# EAGLE design tinyusbboard (EAGLE 7.1.0)
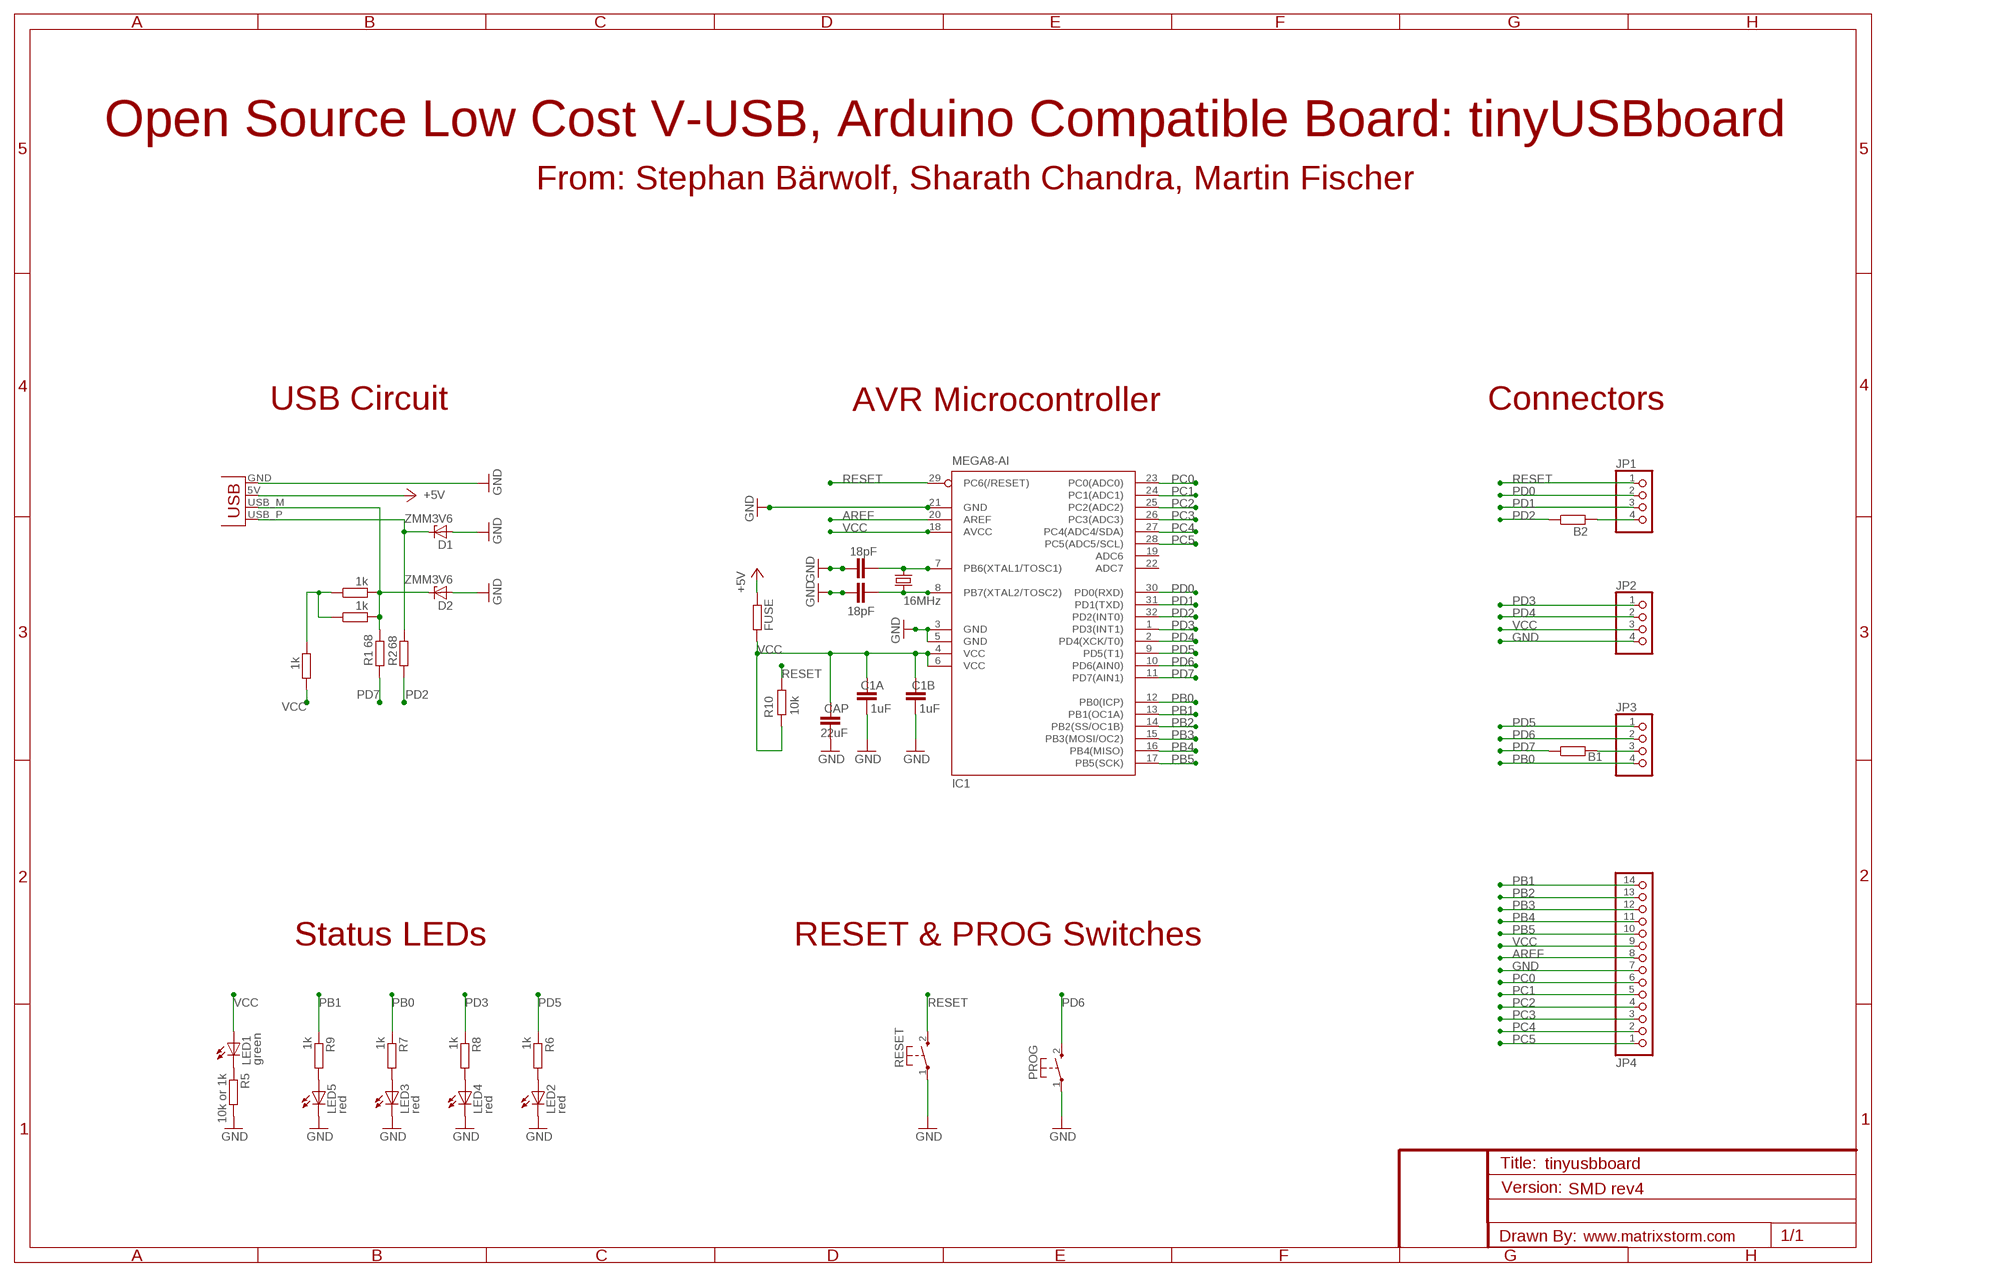
[diagram p0: schematic, sheet 1]

## Parts
AQ1  16MHz  CRYSTAL5X3  [CRYSTAL-SMD-5X3]
B1  0  R-EU_R0805W  [R0805W]
B2  0  R-EU_R0805W  [R0805W]
C1A  1uF  C-EUC0805K  [C0805K]
C1B  1uF  C-EUC0805K  [C0805K]
C2  18pF  C-EUC0805K  [C0805K]
C3  18pF  C-EUC0805K  [C0805K]
CAP  22uF  C-EUC1206K  [C1206K]
D1  ZMM3V6  ZD-SOD-80  [SOD80]
D2  ZMM3V6  ZD-SOD-80  [SOD80]
FUSE  0  R-EU_R1206W  [R1206W]
IC1  MEGA8-AI  [TQFP32-08]
JP1  PINHD-1X4  [1X04]
JP2  PINHD-1X4  [1X04]
JP3  PINHD-1X4  [1X04]
JP4  PINHD-1X14  [1X14]
LED1  green  LEDCHIPLED_0805  [CHIPLED_0805]
LED2  red  LEDCHIPLED_0805  [CHIPLED_0805]
LED3  red  LEDCHIPLED_0805  [CHIPLED_0805]
LED4  red  LEDCHIPLED_0805  [CHIPLED_0805]
LED5  red  LEDCHIPLED_0805  [CHIPLED_0805]
PROG  KSS-2EG4430  [KSS-2EG4430]
Q1  16MHz  CRYSTALHC49S  [HC49/S]
R1  68  R-EU_R0805W  [R0805W]
R2  68  R-EU_R0805W  [R0805W]
R3  1k  R-EU_R0805W  [R0805W]
R3A  1k  R-EU_R0805W  [R0805W]
R3B  1k  R-EU_R0805W  [R0805W]
R5  10k or 1k  R-EU_R0805W  [R0805W]
R6  1k  R-EU_R0805W  [R0805W]
R7  1k  R-EU_R0805W  [R0805W]
R8  1k  R-EU_R0805W  [R0805W]
R9  1k  R-EU_R0805W  [R0805W]
R10  10k  R-EU_R0805W  [R0805W]
RESET  KSS-2EG4430  [KSS-2EG4430]
USB  USBPCB  [USB-A-PCB]

## Nets
+5V: FUSE.1 USB.5V(VBUS)
AREF: IC1.20(AREF) JP4.8
GND: C1A.2 C1B.2 C2.2 C3.2 CAP.2 D1.A D2.A IC1.3(GND) IC1.5(GND) IC1.21(GND) JP2.4 JP4.7 LED2.C LED3.C LED4.C LED5.C PROG.1(P) R5.2 RESET.1(P) USB.GND
N$3: D1.C R2.2 USB.USB_P(D+)
N$5: AQ1.1 C3.1 IC1.7(PB6(XTAL1/TOSC1)) Q1.1
N$6: AQ1.3 C2.1 IC1.8(PB7(XTAL2/TOSC2)) Q1.2
N$13: B2.2 JP1.4
N$27: D2.C R1.2 R3A.2 R3B.2 USB.USB_M(D-)
N$34: B1.2 JP3.3
N$35: LED1.C R5.1
N$36: LED2.A R6.2
N$37: R3.1 R3A.1 R3B.1
N$38: LED3.A R7.2
N$39: LED4.A R8.2
N$40: LED5.A R9.2
PB0: IC1.12(PB0(ICP)) JP3.4 R7.1
PB1: IC1.13(PB1(OC1A)) JP4.14 R9.1
PB2: IC1.14(PB2(SS/OC1B)) JP4.13
PB3: IC1.15(PB3(MOSI/OC2)) JP4.12
PB4: IC1.16(PB4(MISO)) JP4.11
PB5: IC1.17(PB5(SCK)) JP4.10
PC0: IC1.23(PC0(ADC0)) JP4.6
PC1: IC1.24(PC1(ADC1)) JP4.5
PC2: IC1.25(PC2(ADC2)) JP4.4
PC3: IC1.26(PC3(ADC3)) JP4.3
PC4: IC1.27(PC4(ADC4/SDA)) JP4.2
PC5: IC1.28(PC5(ADC5/SCL)) JP4.1
PD0: IC1.30(PD0(RXD)) JP1.2
PD1: IC1.31(PD1(TXD)) JP1.3
PD2: B2.1 IC1.32(PD2(INT0)) R2.1
PD3: IC1.1(PD3(INT1)) JP2.1 R8.1
PD4: IC1.2(PD4(XCK/T0)) JP2.2
PD5: IC1.9(PD5(T1)) JP3.1 R6.1
PD6: IC1.10(PD6(AIN0)) JP3.2 PROG.2(S)
PD7: B1.1 IC1.11(PD7(AIN1)) R1.1
RESET: IC1.29(PC6(/RESET)) JP1.1 R10.1 RESET.2(S)
VCC: C1A.1 C1B.1 CAP.1 FUSE.2 IC1.4(VCC) IC1.6(VCC) IC1.18(AVCC) JP2.3 JP4.9 LED1.A R3.2 R10.2
Unconnected: IC1.19(ADC6) IC1.22(ADC7)

## Notes on the sheet
- Open Source Low Cost V-USB, Arduino Compatible Board: tinyUSBboard
- From: Stephan Bärwolf, Sharath Chandra, Martin Fischer
- USB Circuit | AVR Microcontroller | Connectors
- Status LEDs | RESET & PROG Switches
- SMD rev4
- www.matrixstorm.com

## Library data of the parts
AQ1 = SparkFun:CRYSTAL: Crystals Various standard crystals. Proven footprints. Spark Fun Electronics SKU : COM-00534
B1 B2 FUSE R1-R3 R3A R3B R5-R10 = resistor:R-EU_: RESISTOR, European symbol
C1A C1B C2 C3 CAP = resistor:C-EU: CAPACITOR, European symbol
D1 D2 = diodes:ZD-: Zener diode
IC1 = atmel:MEGA8: MICROCONTROLLER 8 Kbytes FLASH, 1 kbytes SRAM, 512 bytes EEPROM, USART, 6-channel 10 bit ADC, 2-channel 8 bit ADC Pin compatible with Atmega48, ATMega88, ATMega168 Source: avr.lbr; MPN: ATMEGA8-16AU; OC_FARNELL: 9171371; OC_NEWARK: 73M8863
JP1-JP3 = pinhead:PINHD-1X4: PIN HEADER
JP4 = pinhead:PINHD-1X14: PIN HEADER
LED1-LED5 = led:LED: LED OSRAM: - CHIPLED LG R971, LG N971, LY N971, LG Q971, LY Q971, LO R971, LY R971 LH N974, LH R974 LS Q976, LO Q976, LY Q976 LO Q996 - Hyper CHIPLED LW Q18S LB Q993, LB Q99A, LB R99A - SideLED LS A670, LO A670, LY A670, LG A670, LP A670 LB A673, LV A673, LT A673, LW A673 LH A674 LY A675 LS A676, LA A676, LO A676, LY A676, LW A676 LS A679, LY A679, LG A679 - Hyper Micro SIDELED® LS Y876, LA Y876, LO Y876, LY Y876 LT Y87S - SmartLED LW L88C, LW L88S LB L89C, LB L89S, LG L890 LS L89K, LO L89K, LY L89K LS L896, LA L896, LO L896, LY L896 - TOPLED LS T670, LO T670, LY T670, LG T670, LP T670 LSG T670, LSP T670, LSY T670, LOP T670, LYG T670 LG T671, LOG T671, LSG T671 LB T673, LV T673, LT T673, LW T673 LH T674 LS T676, LA T676, LO T676, LY T676, LB T676, LH T676, LSB T676, LW T676 LB T67C, LV T67C, LT T67C, LS T67K, LO T67K, LY T67K, LW E67C LS E67B, LA E67B, LO E67B, LY E67B, LB E67C, LV E67C, LT E67C LW T67C LS T679, LY T679, LG T679 LS T770, LO T770, LY T770, LG T770, LP T770 LB T773, LV T773, LT T773, LW T773 LH T774 LS E675, LA E675, LY E675, LS T675 LS T776, LA T776, LO T776, LY T776, LB T776 LHGB T686 LT T68C, LB T68C - Hyper Mini TOPLED® LB M676 - Mini TOPLED Santana® LG M470 LS M47K, LO M47K, LY M47K Source: http://www.osram.convergy.de LUXEON: - LUMILED® LXK2-PW12-R00, LXK2-PW12-S00, LXK2-PW14-U00, LXK2-PW14-V00 LXK2-PM12-R00, LXK2-PM12-S00, LXK2-PM14-U00 LXK2-PE12-Q00, LXK2-PE12-R00, LXK2-PE12-S00, LXK2-PE14-T00, LXK2-PE14-U00 LXK2-PB12-K00, LXK2-PB12-L00, LXK2-PB12-M00, LXK2-PB14-N00, LXK2-PB14-P00, LXK2-PB14-Q00 LXK2-PR12-L00, LXK2-PR12-M00, LXK2-PR14-Q00, LXK2-PR14-R00 LXK2-PD12-Q00, LXK2-PD12-R00, LXK2-PD12-S00 LXK2-PH12-R00, LXK2-PH12-S00 LXK2-PL12-P00, LXK2-PL12-Q00, LXK2-PL12-R00 Source: www.luxeon.com KINGBRIGHT: KA-3528ASYC Source: www.kingbright.com
PROG RESET = buttons:KSS-2EG4430: Size: 3x6mm Height: 5mm from PCB Rating: DC12v 50mA Travel: 0.25±0.10mm Operating Force: 180±50gf Return Force: 60gf min Contact resistance: 100m? max Insulation resistance: 100M? min Operating life?50,000 cycles
Q1 = crystal:CRYSTAL: CRYSTAL; OC_FARNELL: 1667008; OC_NEWARK: unknown
USB = SparkFun:USB: USB Connectors USB-B-PTH is fully proven SKU : PRT-00139 USB-miniB is fully proven SKU : PRT-00587 USB-A-PCB is untested. USB-A-H is throughly reviewed, but untested. Spark Fun Electronics SKU : PRT-00437 USB-B-SMT is throughly reviewed, but untested. Needs silkscreen touching up. USB-A-S has not been used/tested USB-MB-H has not been used/tested

## Board
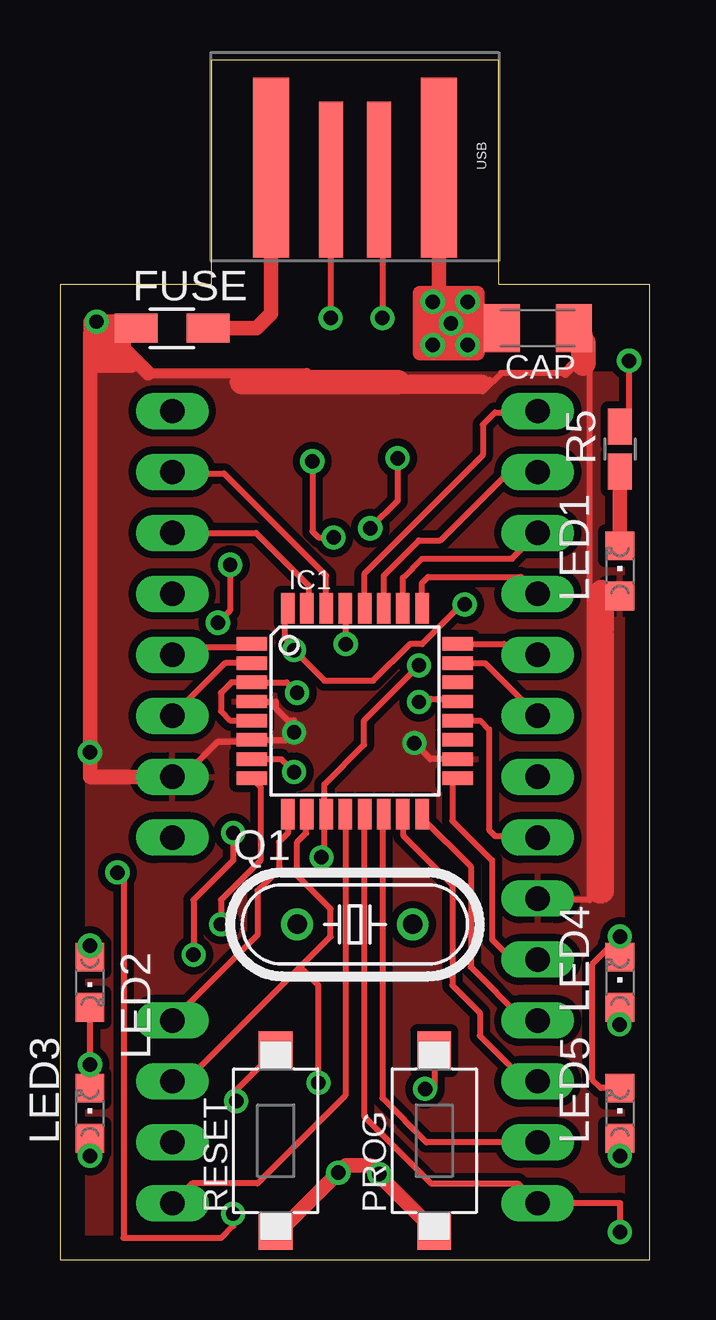
[diagram p1: board, top side]
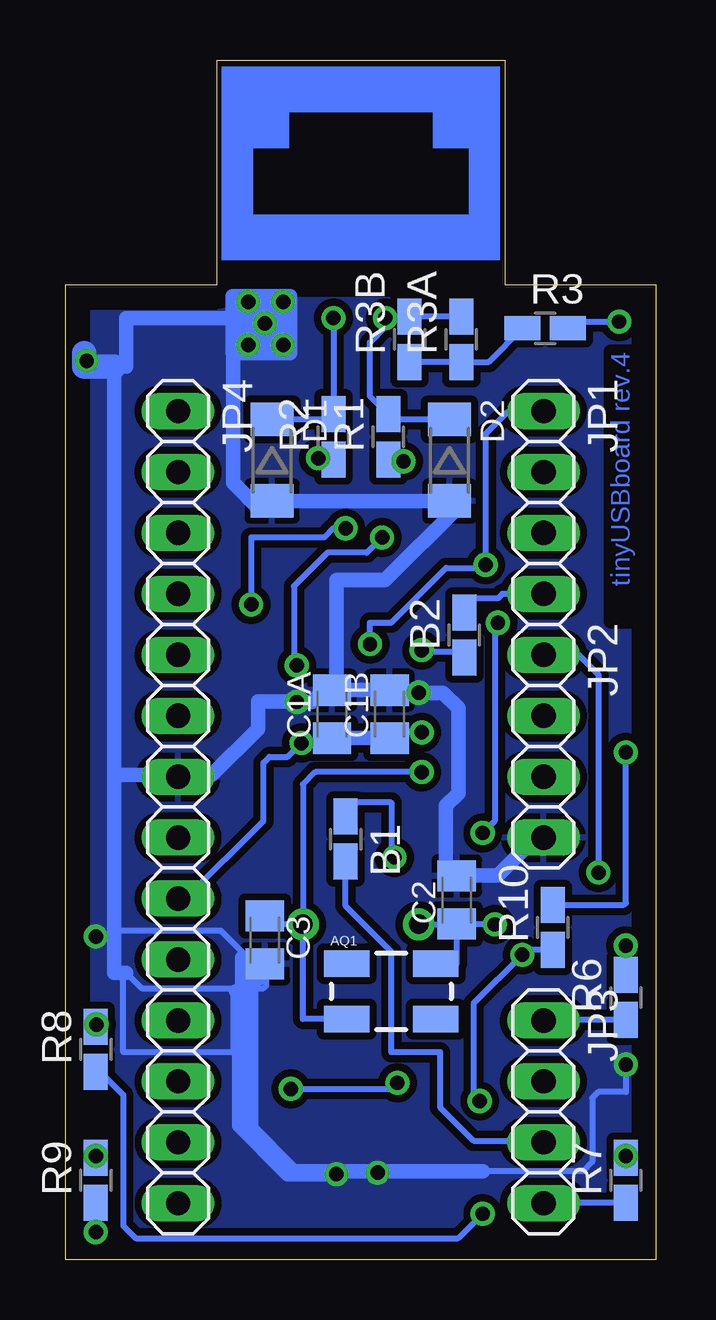
[diagram p2: board, bottom side, seen from below]

Size 24.6 x 50 mm. Coordinates in mm from the lower left corner, seen from the top.
Outline: 0,0 24.6,0 24.6,40.64 18.3,40.64 18.3,50 6.3,50 6.3,40.64 0,40.64 0,0
Copper layers (1*16): Top 0.035mm / dielectric 1.5mm / Bottom 0.035mm
Design rules "default": minimum track width 10mil, minimum drill 24mil, track to track 8mil, track to pad 8mil, pad to pad 8mil, via to via 8mil, smd to smd 8mil, copper to edge 40mil, drill to drill 8mil, minimum pad ring 10mil, minimum via ring 8mil, stop-mask expansion 4mil, vias tented up to drill 0mil, thermal gap 10mil

### Footprints (pad centres in the part's own frame; a part is rotated, then mirrored left to right if it is on the bottom)
CRYSTAL-SMD-5X3 = smd 1.9 x 1.1: 1 -1.85,-1.15; 2 1.85,-1.15; 3 1.85,1.15; 4 -1.85,1.15
R0805W = smd 1.5 x 1: 1 -0.94,0; 2 0.94,0
C0805K = smd 1.3 x 1.6: 1 -1,0; 2 1,0
C1206K = smd 1.5 x 2: 1 -1.5,0; 2 1.5,0
SOD80 = smd 1.4 x 1.8: A 1.7,0; C -1.7,0
R1206W = smd 1.8 x 1.2: 1 1.499,0; 2 -1.499,0
TQFP32-08 = smd 1.27 x 0.559: 1 -4.293,2.8; 2 -4.293,2; 3 -4.293,1.2; 4 -4.293,0.4; 5 -4.293,-0.4; 6 -4.293,-1.2; 7 -4.293,-2; 8 -4.293,-2.8; 17 4.293,-2.8; 18 4.293,-2; 19 4.293,-1.2; 20 4.293,-0.4; 21 4.293,0.4; 22 4.293,1.2; 23 4.293,2; 24 4.293,2.8 | smd 0.559 x 1.27: 9 -2.8,-4.293; 10 -2,-4.293; 11 -1.2,-4.293; 12 -0.4,-4.293; 13 0.4,-4.293; 14 1.2,-4.293; 15 2,-4.293; 16 2.8,-4.293; 25 2.8,4.293; 26 2,4.293; 27 1.2,4.293; 28 0.4,4.293; 29 -0.4,4.293; 30 -1.2,4.293; 31 -2,4.293; 32 -2.8,4.293
1X04 = drill 1.016 long: 1 -3.81,0; 2 -1.27,0; 3 1.27,0; 4 3.81,0
1X14 = drill 1.016 long: 1 -16.51,0; 2 -13.97,0; 3 -11.43,0; 4 -8.89,0; 5 -6.35,0; 6 -3.81,0; 7 -1.27,0; 8 1.27,0; 9 3.81,0; 10 6.35,0; 11 8.89,0; 12 11.43,0; 13 13.97,0; 14 16.51,0
CHIPLED_0805 = smd 1.2 x 1.2: A 0,-1.05; C 0,1.05
KSS-2EG4430 = smd 1.6 x 1.4: 1 -3.75,0; 2 3.75,0
HC49/S = drill 0.813: 1 2.413,0; 2 -2.413,0
USB-A-PCB = smd 7.5 x 1.5: 5V -0.2,-3.5; GND -0.2,3.5 | smd 6.5 x 1: USB_M 0.3,-1; USB_P 0.3,1

### Placement (x,y rotation side)
AQ1  11.03,11.18 0 bottom
B1  12.94,17.53 270 bottom
B2  7.98,26.04 90 bottom
C1A  13.5,22.73 90 bottom
C1B  11.1,22.73 90 bottom
C2  8.3,14.99 90 bottom
C3  16.3,13.32 270 bottom
CAP  19.92,38.82 180 top
D1  16,33.32 270 bottom
D2  8.6,33.32 270 bottom
FUSE  4.68,38.82 0 top
IC1  12.3,22.86 0 top
JP1  4.68,31.55 270 bottom
JP2  4.68,21.39 270 bottom
JP3  4.68,6.16 270 bottom
JP4  19.92,18.86 270 bottom
LED1  23.35,28.7 0 top
LED2  1.25,11.56 180 top
LED3  1.25,6.1 0 top
LED4  23.35,11.56 0 top
LED5  23.35,6.1 0 top
PROG  15.61,4.95 90 top
Q1  12.3,13.97 0 top
R1  11.16,34.29 90 bottom
R2  13.44,34.29 90 bottom
R3  4.62,38.82 0 bottom
R3A  8.11,38.35 90 bottom
R3B  10.27,38.35 90 bottom
R5  23.35,33.78 90 top
R6  1.25,10.92 90 bottom
R7  1.25,3.3 90 bottom
R8  23.35,8.76 90 bottom
R9  23.35,3.3 90 bottom
R10  4.3,13.84 90 bottom
RESET  8.99,4.95 90 top
USB  12.3,45.32 270 top

### Tracks (layer width: path | path; a pad name or v marks a point on that pad's centre or on a via)
+5V
  Top 0.61: USB.5V 8.8,44.07 8.8,39.43 8.19,38.82 FUSE.1
AREF
  Top 0.254: 17.13,22.61 16.74,22.61 IC1.20 17.53,22.46 17.89,22.1 17.89,17.91 18.14,17.65 19.85,17.65 JP4.8
GND  (via drill 0.6)
  Top 0.254: IC1.5 7.99,22.48 7.09,22.48 6.71,22.86 6.71,23.62 7.15,24.06 IC1.3 9.45,24.06 v9.89,23.62 | 16.61,23.24 IC1.21 16.48,23.37 15.48,23.37 15.22,23.11 v14.97,23.24 | v15.54,39.92 15.98,39.31 15.8,39.5 | R5.2 23.35,35.05 23.73,35.05 v23.73,37.47 | LED2.C v1.25,8.13 LED3.C | LED4.C v23.35,13.46 22.21,12.32 22.21,7.49 22.55,7.15 LED5.C | v17,39.92 16.52,39.92 16.52,39.85
  Top 0.61: 9.05,1.14 RESET.1 9.19,1.2 v11.6,3.62 11.92,3.94 12.88,3.94 | USB.GND 15.8,44.07 15.8,39.5 15.8,39.43 v15.54,39.92 16.24,39.12 | 12.88,3.94 PROG.1 | 12.88,3.94 12.94,3.94 v13.32,3.56 | 15.39,40.29 17.4,40.29 17.4,37.77 15.01,37.77 15.01,40.29 15.39,40.29 | 15.39,40.29 15.39,38.21 16.9,38.21 16.9,39.85 16.52,39.85 15.89,39.85 15.89,38.65
  Top 1.27: CAP.2 18.42,39.12 16.24,39.12
  Bottom 0.254: 22.08,11.94 21.44,11.3 17.63,11.3 | 16.75,11.3 16.36,11.3 16.24,11.43 16.24,11.89 C3.2 16.3,11.75 16.75,11.3 | 16.75,11.3 16.87,11.3 17.13,11.3 17.25,11.3 17.63,11.3 | 17.63,11.3 17.63,8.64 22.21,8.64 22.21,11.94 | 15.88,31.5 D1.A | JP4.7 19.92,20.19 | 8.36,16.05 C2.2 | 22.08,37.47 22.08,37.21 | 22.59,12.19 22.46,12.19 22.46,13.21 | 22.46,13.21 22.46,13.72 | 22.46,13.72 22.46,20.19 | v1.25,8.13 1.25,6.98 2.39,6.98 2.65,6.73 2.65,4.06 3.03,3.68 7.22,3.68 | v23.35,13.46 22.71,13.46 22.46,13.21 | 22.46,13.72 18.14,13.72 16.49,12.06
  Bottom 0.61: 22.08,37.21 22.08,39.24 15.54,39.24 v15.54,39.92 17.63,37.72 17.63,32.38 16.49,31.24 16.38,31.24 D1.A D2.A 8.35,31.37 8.24,31.37 11.28,28.32 13.32,28.32 13.32,23.92 C1A.2 | C1A.2 C1B.2 10.99,23.62 v9.89,23.62 8.87,23.62 8.24,22.99 8.24,19.43 8.74,18.92 8.74,16.38 8.7,16.38 C2.2 8.28,16 6.59,16 5,17.59 JP2.4 | C1A.2 13.84,23.73 14.33,23.24 v14.97,23.24 14.99,23.26 IC1.21 16.59,22.12 18.52,20.19 19.85,20.19 JP4.7 | 19.92,20.19 22.46,20.19 | 22.08,11.94 22.21,11.94 22.59,11.94 22.59,12.19 | 7.22,3.68 11.54,3.68 | 11.54,3.68 v11.6,3.62 | v13.32,3.56 15.35,3.56 15.48,3.68 | 17.38,11.05 17.38,5.59 15.48,3.68 | 17.38,11.05 17.13,11.3 | 16.49,12.06 17.25,11.3 17.25,12.57 | 16.87,11.3 16.87,5.46 15.22,3.81 | 17.51,11.18 17.38,11.18 17.38,11.05 | 15.48,3.68 11.54,3.68 | 22.59,37.21 22.59,12.06 | 17.15,40.16 15.26,40.16 15.26,37.77 17.66,37.77 17.66,40.16 17.15,40.16 | 17.15,40.16 17.15,38.21 15.77,38.21 15.77,38.27 15.83,38.27 15.83,39.66 16.77,39.66 16.77,39.72 16.33,39.72 16.33,38.59
  Bottom 1.016: 22.59,37.21 23.83,37.21 23.83,37.77
  other vias: 16.3,39.02 17,38.12 15.54,38.12
  pour Bottom (isolate 0.305): 0.2,40.12 24.4,40.12 24.4,0.32 0.2,0.32
N$3  (via drill 0.6)
  Top 0.254: USB.USB_P 13.44,43.78 v13.44,39.24
  Bottom 0.254: v13.44,39.24 R2.2 13.65,35.02 D1.C
N$5  (via drill 0.6)
  Top 0.254: IC1.7 9.22,20.86 v9.76,20.32
  Bottom 0.254: Q1.1 14.73,13.95 14.75,13.97 15.86,13.97 16.21,14.32 C3.1 | Q1.1 14.71,19.81 14.21,20.32 v9.76,20.32 | AQ1.1 14.71,10.03 Q1.1
N$6  (via drill 0.6)
  Top 0.254: v6.71,13.97 6.71,14.99 8.36,16.64 8.36,19.7 IC1.8
  Bottom 0.254: Q1.2 7.87,13.97 C2.1 | C2.1 8.28,13.97 v6.71,13.97 | AQ1.3 8.3,12.33 C2.1
N$13
  Bottom 0.254: JP1.4 6.4,27.75 6.59,27.56 7.86,27.56 7.86,27.1 B2.2
N$27  (via drill 0.6)
  Top 0.254: USB.USB_M 11.28,43.92 v11.28,39.24
  Bottom 0.254: R3A.2 R3B.2 10.27,39.24 v11.28,39.24 11.28,38.86 11.92,38.23 11.92,35.99 R1.2 | R1.2 10.98,35.05 | D2.C 10.95,35.02 R1.2
N$34
  Bottom 0.254: JP3.3 4.75,4.95 7.6,4.95 9,6.35 9,8.64 11.03,8.64 11.03,12.83 12.94,14.73 B1.2
N$35
  Top 0.61: R5.1 LED1.C
N$36  (via drill 0.6)
  Top 0.254: v1.25,13.08 LED2.A
  Bottom 0.254: R6.2 v1.25,13.08
N$37
  Bottom 0.254: R3B.1 R3A.1 6.96,37.41 R3.1
N$38  (via drill 0.6)
  Top 0.254: LED3.A v1.25,4.32
  Bottom 0.254: v1.25,4.32 R7.2
N$39  (via drill 0.6)
  Top 0.254: LED4.A 23.33,10.51 v23.33,9.8
  Bottom 0.254: v23.33,9.8 23.35,9.11 R8.2
N$40  (via drill 0.6)
  Top 0.254: LED5.A v23.35,4.32
  Bottom 0.254: v23.35,4.32 R9.2
PB0
  Top 0.254: IC1.12 11.9,6.84 8.24,3.18 5.51,3.18 JP3.4
  Bottom 0.254: R7.1 4.68,2.36 JP3.4
PB1  (via drill 0.6)
  Top 0.254: IC1.13 12.68,18.55 12.68,5.97 15.48,3.18 19.09,3.18 JP4.14 23.33,2.34 R9.1 v23.35,1.14
  Bottom 0.254: v23.35,1.14 R9.1
PB2
  Top 0.254: JP4.13 15.29,4.88 13.44,6.73 13.44,18.51 IC1.14
PB3
  Top 0.254: 19.41,7.43 19.23,7.43 | 14.21,18.47 IC1.15 14.33,18.54 14.33,17.65 16.36,15.62 16.36,11.43 17.51,10.29 17.51,9.33 19.41,7.43 | JP4.12 19.41,7.43
PB4
  Top 0.254: IC1.16 15.1,18.41 17.13,16.38 17.13,12.19 19.29,10.03 19.85,10.03 JP4.11
PB5
  Top 0.254: IC1.17 16.37,20.06 16.36,20.07 16.36,18.29 18.02,16.64 18.02,13.34 18.9,12.45 19.86,12.45 JP4.10
PC0
  Top 0.254: IC1.23 17.73,24.86 JP4.6
PC1
  Top 0.254: 16.62,25.69 IC1.24 18.52,25.66 19.03,25.15 19.86,25.15 JP4.5
PC2
  Top 0.254: IC1.25 15.1,28.2 15.35,28.45 19.22,28.45 JP4.4
PC3
  Top 0.254: IC1.26 14.3,28.42 15.09,29.21 18.84,29.21 JP4.3
PC4
  Top 0.254: IC1.27 13.5,28.51 14.97,29.97 15.86,29.97 18.65,32.77 19.86,32.77 JP4.2
PC5
  Top 0.254: 12.68,27.17 IC1.28 12.7,28.59 17.63,33.53 17.63,34.8 18.14,35.31 19.86,35.31 JP4.1
PD0
  Top 0.254: IC1.30 11.1,28.51 6.84,32.77 4.68,32.77 JP1.2
PD1
  Top 0.254: IC1.31 10.3,27.46 10.4,27.56 10.4,28.07 8.18,30.29 JP1.3
PD2  (via drill 0.6)
  Top 0.254: v16.87,27.3 16.75,27.3 15.09,25.65 14.59,25.65 13.06,24.13 11.03,24.13 v9.76,25.4 10.01,25.65 9.63,25.65 9.38,25.91 9.38,27.03 IC1.32 | v12.94,30.48 14.08,31.62 v14.08,33.4
  Bottom 0.254: R2.1 13.44,32.77 v14.08,33.4 | v16.87,27.3 16.87,30.1 13.82,30.1 13.44,30.48 v12.94,30.48 | v9.76,25.4 9.71,25.35 8.24,25.35 B2.1
PD3  (via drill 0.6)
  Top 0.254: JP2.1 5.76,25.2 6.08,25.53 7.87,25.53 IC1.1 | v7.22,1.91 7.22,1.4 6.71,0.89 2.65,0.89 2.65,15.88 v2.39,16.13
  Bottom 0.254: 22.97,7.62 23.35,7.62 R8.1 23.17,7.82 22.21,6.86 22.21,1.4 21.7,0.89 8.24,0.89 v7.22,1.91 | JP2.1 4.61,25.27 3.28,25.27 2.39,24.38 v2.39,16.13
PD4
  Top 0.254: IC1.2 6.88,24.86 JP2.2
PD5
  Top 0.254: JP3.1 8.24,13.52 8.24,15.37 9.12,16.26 9.12,17.4 9.5,17.77 IC1.9
  Bottom 0.254: R6.1 4.68,9.98 JP3.1
PD6  (via drill 0.6)
  Top 0.254: JP3.2 5.25,7.43 10.01,12.19 | 10.01,12.19 11.28,13.46 11.28,14.61 9.89,16 9.89,17.4 10.27,17.78 10.27,18.54 IC1.10 | PROG.2 15.61,7.12 v15.22,7.11 | v10.78,7.37 10.78,11.43 10.01,12.19
  Bottom 0.254: v15.22,7.11 11.03,7.11 v10.78,7.37
PD7  (via drill 0.6)
  Top 0.254: IC1.11 11.03,18.64 11.03,19.81 12.68,21.46 12.68,22.48 v14.97,24.77 | IC1.11 11.03,18.57 | v10.52,33.27 10.52,30.35 10.78,30.1 v11.41,30.1 | v10.9,16.76 11.03,16.89 11.03,18.5 IC1.11
  Bottom 0.254: R1.1 10.78,32.97 10.83,32.97 | 11.34,32.97 10.83,32.97 | 10.83,32.97 v10.52,33.27 | v14.97,24.77 15.09,24.89 15.09,28.07 13.7,29.46 12.05,29.46 v11.41,30.1 | B1.1 12.68,18.47 12.68,19.05 11.03,19.05 11.03,16.89 v10.9,16.76
RESET  (via drill 0.6)
  Top 0.254: IC1.29 11.9,25.67 v11.92,25.65 | v7.09,28.96 7.09,27.05 v6.59,26.54 | v7.22,17.78 7.22,16.64 5.57,14.99 v5.57,12.7 | v7.35,6.6 7.35,7.06 RESET.2
  Bottom 0.254: v11.92,25.65 11.92,26.54 11.03,26.54 8.74,28.83 7.22,28.83 v7.09,28.96 7.09,34.42 6.2,35.31 4.68,35.31 JP1.1 | v6.59,26.54 6.71,26.42 6.71,18.29 v7.22,17.78 | v7.35,6.6 7.6,6.86 7.6,10.67 v5.57,12.7 5.37,12.9 R10.1
VCC  (via drill 0.6)
  Top 0.254: JP2.3 5.12,20.12 6.59,21.59 8.11,21.59 8.04,21.66 IC1.6 9.45,21.66 v9.76,21.97 9.76,22.48 9.51,22.48 9,22.99 9,23.24 8.03,23.24 IC1.4 | 16.5,20.96 IC1.18 15.44,20.86 v14.78,21.53 | 21.42,37.31 CAP.1 22.08,38.61 22.08,37.27 22.08,27.18 | 22.08,27.18 22.08,14.99 19.92,14.99 | 19.92,14.99 JP4.9 | LED1.A 22.97,27.65 22.97,27.18 22.08,27.18 | 21.06,36.96 18.4,36.96 17.63,36.2 8.11,36.2 10.3,36.96 | 19.79,14.99 19.92,14.99 | 3.66,36.96 3.67,36.95 | 1.53,38.53 1.53,38.61 1.4,38.61
  Top 0.406: 21.42,37.31 21.06,36.96 | 17.63,36.58 17.89,36.58 | 21.83,37.34 22.08,37.34 22.08,37.27 | 3.66,36.96 10.3,36.96
  Top 0.61: JP2.3 1.25,20.12 v1.25,21.14 1.25,38.61 1.4,38.61 2.66,38.61 | 14.08,36.58 17.63,36.58 | FUSE.2 2.97,38.61 2.66,38.61 | 1.78,38.53 1.53,38.53 v1.53,39.09 | 3.67,36.95 2.66,37.96 2.66,38.61 | 2.66,39.09 v1.53,39.09 | v1.53,39.09 1.28,39.09 1.28,37.27 2.35,37.27 | 2.98,37.27 2.35,37.27 | 2.35,37.27 2.35,38.09 1.78,38.09 1.78,38.15 1.72,38.15 1.72,37.77 1.97,37.77 1.97,37.71
  Top 1.016: 22.59,26.04 22.59,15.37 22.46,15.37 | 22.59,26.29 22.59,27.81 | 7.6,36.58 14.08,36.58 | 21.83,38.23 21.83,37.34
  Bottom 0.254: 10.83,21.46 C1B.1 10.86,21.97 v9.76,21.97 | JP4.9 19.61,15.04 16.36,18.29 16.36,20.7 16.11,20.96 15.35,20.96 v14.78,21.53 13.71,21.53 C1A.1 13.64,21.59 14.08,21.59 | R10.2 1.33,14.78 1.25,14.86 v1.25,21.14 | R3.2 3.68,39.09 v1.53,39.09
  Bottom 0.61: C1B.1 C1A.1
  pour Top (isolate 0.305): 0.2,37.02 24.4,37.02 24.4,0.32 0.2,0.32
(copper drawn outside any net)
  shapes: Bottom area x6

### Text on the board
Bottom: tinyUSBboard rev.4
bDocu: 2x 68R | B2 | 2x .1uF | B1 | 18pF | 10k | 18pF | empty
top_labels: matrixstorm.com | FUSE | CAP | RST | A5 | PC5 | PD0 | A4 | PC4 | PD1 | A3 | PC3 | PD2 | A2 | PC2 | PD3 | A1 | PC1 | PD4 | A0 | PC0 | Stephan / Bärwolf, / Sharath / Chandra, / Martin / Fischer | Vcc | GND | GND | REF | Vcc | PB5 | RESET | PROG | PD5 | PB4 | PD6 | PB3 | PD7 | PB2 | Ilmenau / 18.10.2014 | PB1 | PB0